# EAGLE design 24vAudioSupply (EAGLE 7.1.0)
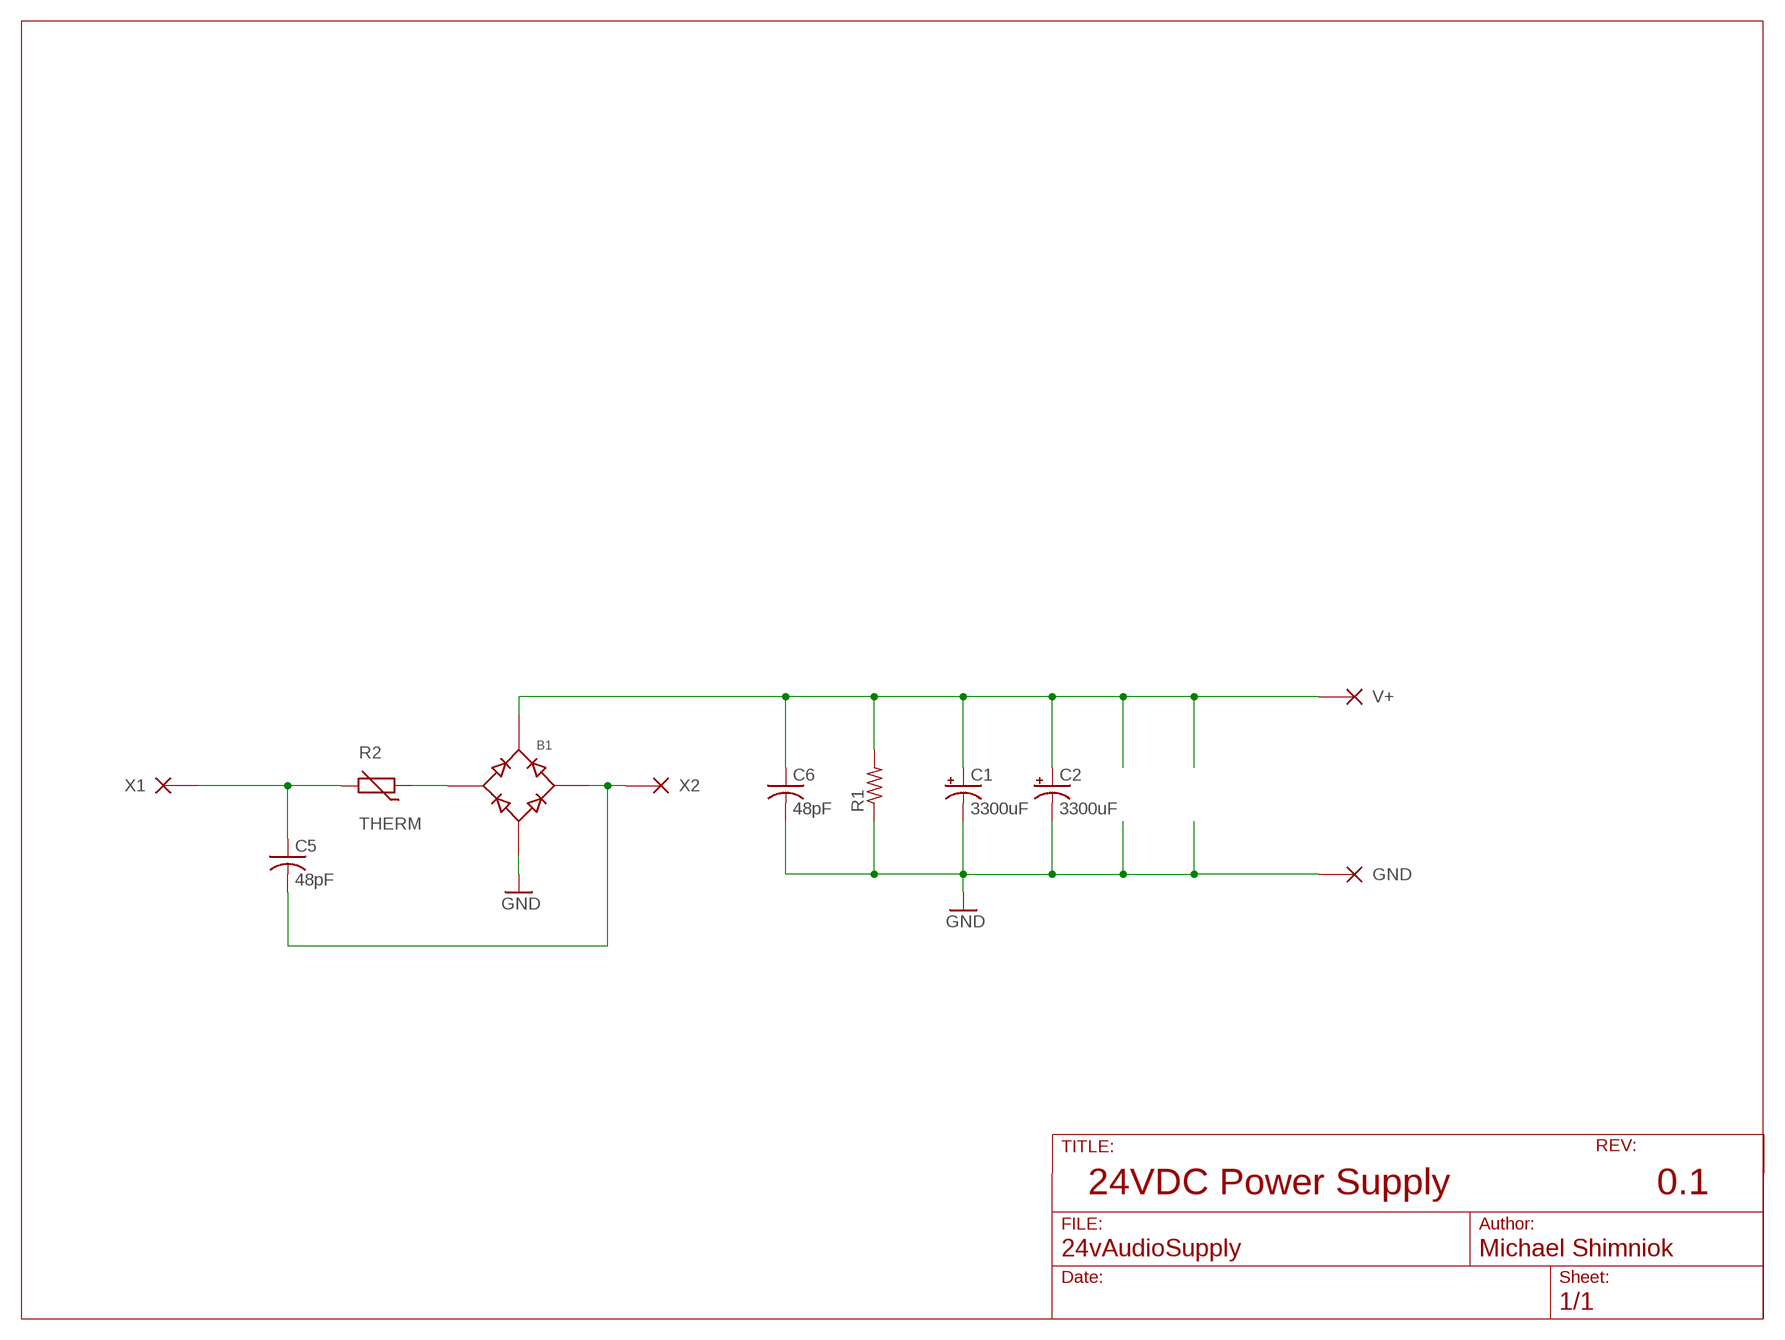
[diagram p0: schematic, sheet 1]

## Parts
B1  RECTIFIER-GBPC-W  [GBPC-W]
C1  3300uF  CPOL-USE7.5-18  [E7,5-18]
C2  3300uF  CPOL-USE7.5-18  [E7,5-18]
C5  48pF  C-075PTH  [C075]
C6  48pF  C-075PTH  [C075]
R1  R0204/7-PTH  [0204/7]
R2  THERM  THERMISTOR-7,5  [R-7,5]
X1  X1  WIREPAD_14GA  [PAD_14GA]
X2  X2  WIREPAD_14GA  [PAD_14GA]
X3  V+  WIREPAD_12GA  [PAD_12GA]
X4  GND  WIREPAD_12GA  [PAD_12GA]

## Nets
GND: B1.V-(-) C1.- C2.- C6.2(-) R1.1 X4.P$1(P)
N$1: C5.1(+) R2.2 X1.P$1(P)
V+: B1.V+(+) C1.+ C2.+ C6.1(+) R1.2 X3.P$1(P)
X1: B1.AC1 R2.1
X2: B1.AC2 C5.2(-) X2.P$1(P)

## Notes on the sheet
- 24VDC Power Supply | 0.1

## Library data of the parts
B1 = bt_diode:RECTIFIER: Bridge Rectifier Standard diode bridge rectifier, common footprints
C1 C2 = rcl:CPOL-US: POLARIZED CAPACITOR, American symbol
C5 C6 = bt_rcl:C: Capacitor, non-polarized, American symbol
R1 = bt_rcl:R: Resistor, American symbol
R2 = varistor:THERMISTOR: THERMISTOR
X1-X4 = bt_electromech:WIREPAD: PIN PAD Generic pin pad / wire pad / wirepad connector

## Board
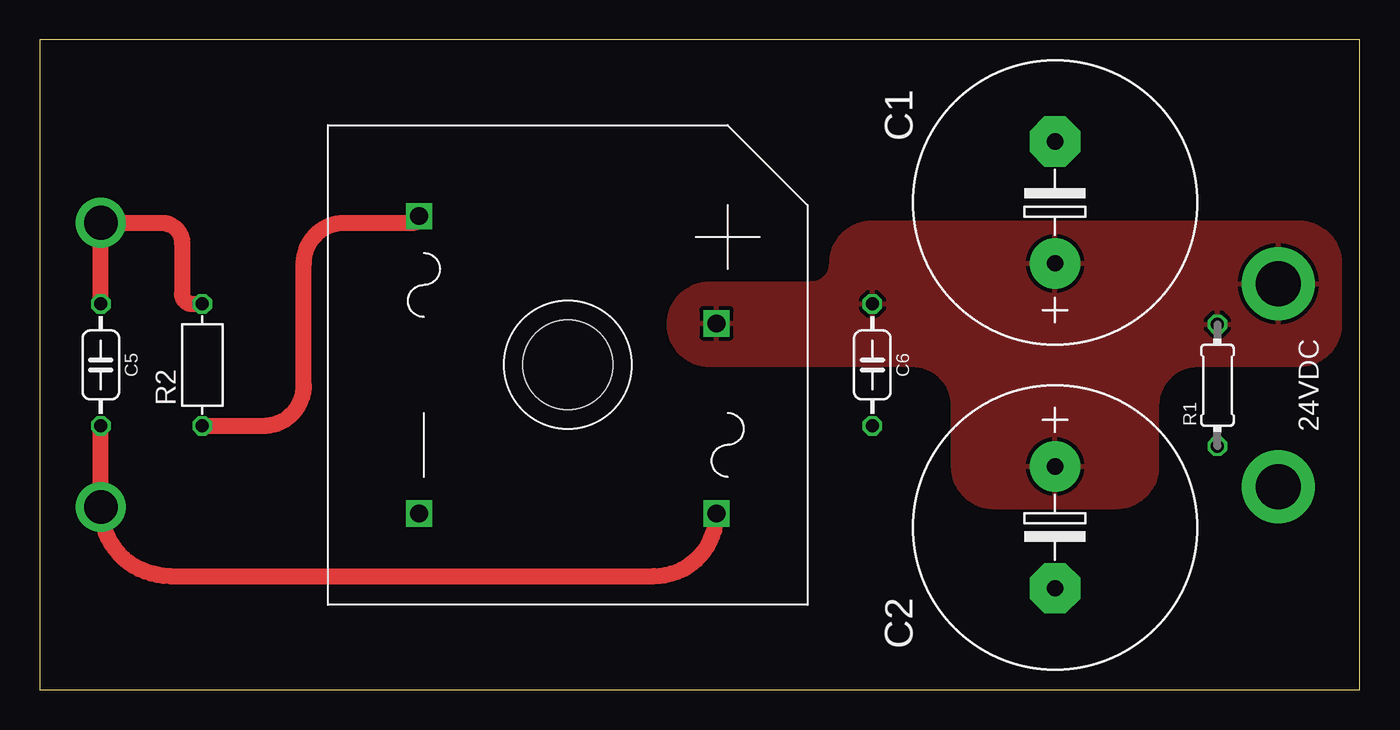
[diagram p1: board, top side]
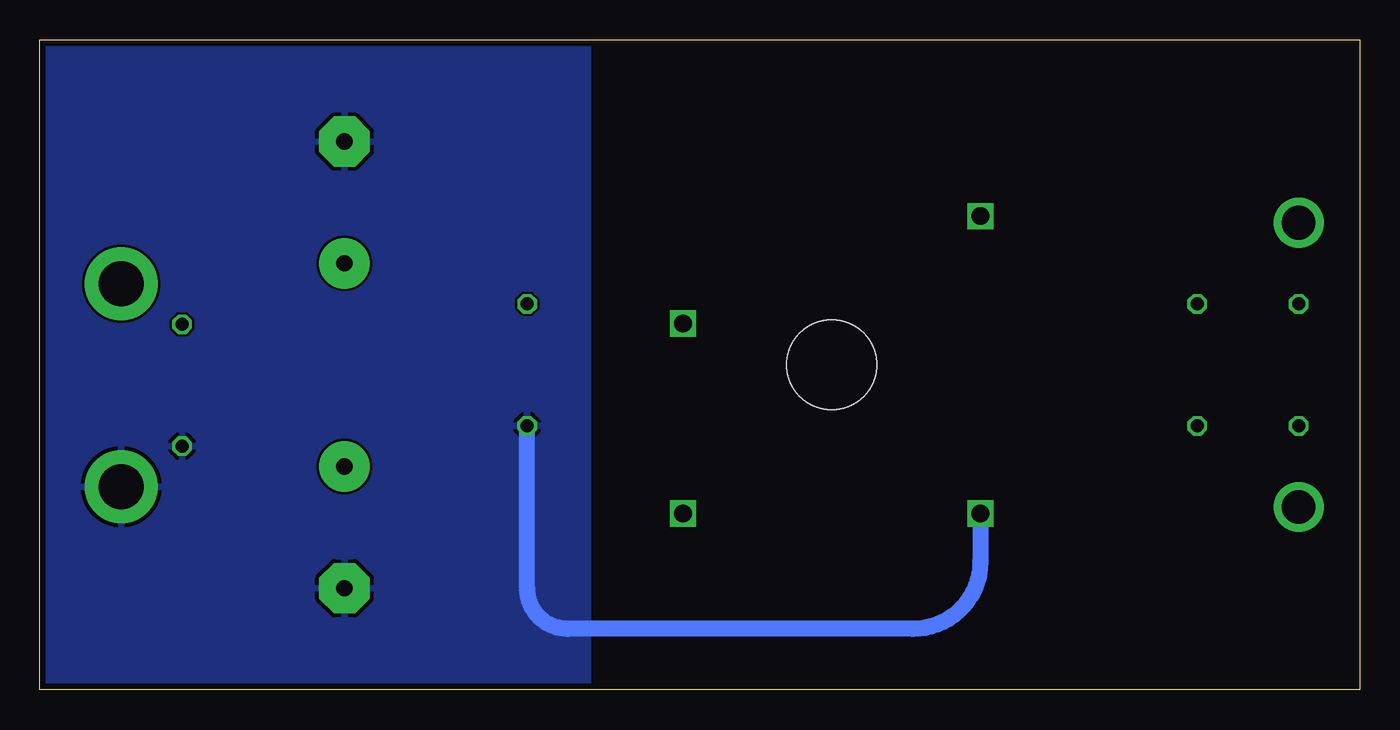
[diagram p2: board, bottom side, seen from below]

Size 82.55 x 40.64 mm. Coordinates in mm from the lower left corner, seen from the top.
Outline: 0,0 82.55,0 82.55,40.64 0,40.64 0,0
Copper layers (1*16): Top 0.035559375mm / dielectric 1.6mm / Bottom 0.035559375mm
Design rules "oshpark-2layer": minimum track width 6mil, minimum drill 10mil, track to track 6mil, track to pad 6mil, pad to pad 6mil, via to via 6mil, smd to smd 0mil, copper to edge 15mil, drill to drill 6mil, minimum pad ring 5mil, minimum via ring 5mil, stop-mask expansion 2.5mil, vias tented up to drill 0mil, thermal gap 10mil

### Footprints (pad centres in the part's own frame; a part is rotated, then mirrored left to right if it is on the bottom)
GBPC-W = drill 1.1 square: AC1 -9.3,9.3; AC2 9.3,-9.3; V+ 9.3,2.6; V- -9.3,-9.3 | hole 5.6: 0,0
E7,5-18 = drill 1.016 pad 3.15: + -3.81,0 | drill 1.016 pad 3.15 octagon: - 3.81,0
C075 = drill 0.813 octagon: 1 -3.81,0; 2 3.81,0
0204/7 = drill 0.813 octagon: 1 -3.81,0; 2 3.81,0
R-7,5 = drill 0.813 octagon: 1 -3.81,0; 2 3.81,0
PAD_14GA = drill 2.1: P$1 0,0
PAD_12GA = drill 2.8 pad 4.572: P$1 0,0

### Placement (x,y rotation side)
B1  33.02,20.32 0 top
C1  63.5,30.48 90 top
C2  63.5,10.16 270 top
C5  3.81,20.32 270 top
C6  52.07,20.32 270 top
R1  73.66,19.05 90 top
R2  10.16,20.32 90 top
X1  3.81,29.21 270 top
X2  3.81,11.43 270 top
X3  77.47,25.4 90 top
X4  77.47,12.7 270 top

### Tracks (layer width: path | path; a pad name or v marks a point on that pad's centre or on a via)
GND
  Bottom 1.016: B1.V- 23.72,8.03 arc90 27.94,3.81 49.53,3.81 arc90 52.07,6.35 C6.2
  pour Bottom: 48.26,0 82.55,0 82.55,40.64 48.26,40.64
N$1
  Top 1.016: C5.1 X1.P$1 7.62,29.21 arc-90 8.89,27.94 8.89,24.77 arc90 9.53,24.13 R2.2
V+
  pour Top: 52.07,29.21 78.74,29.21 arc-90 81.28,26.67 81.28,22.86 arc-90 78.74,20.32 72.39,20.32 arc90 69.85,17.78 69.85,13.97 arc-90 67.31,11.43 59.69,11.43 arc-90 57.15,13.97 57.15,17.78 arc90 54.61,20.32 41.91,20.32 arc-90 39.37,22.86 arc-90 41.91,25.4 48.26,25.4 arc90 49.53,26.67 arc-90
X1
  Top 1.016: R2.1 13.97,16.51 arc90 16.51,19.05 16.51,26.67 arc-90 19.05,29.21 23.31,29.21 arc90 B1.AC1
X2
  Top 1.016: C5.2 X2.P$1 arc90 8.13,7.11 38.41,7.11 arc90 B1.AC2

### Text on the board
tNames: 24VDC